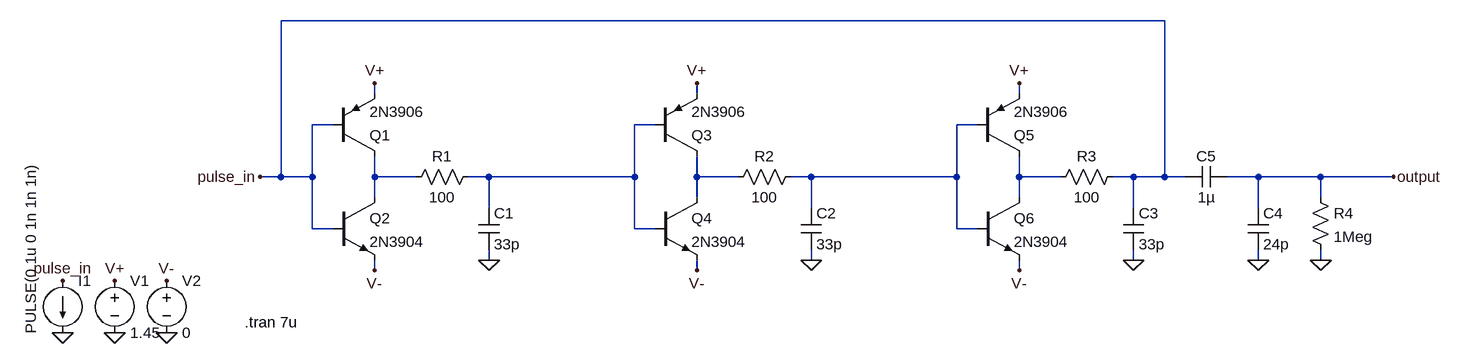
[diagram p0: schematic task1.asc]
task1.asc, the LTspice schematic file:
Version 4
SHEET 1 1920 680
WIRE 1472 -608 112 -608
WIRE 256 -496 256 -512
WIRE 752 -496 752 -512
WIRE 1248 -496 1248 -512
WIRE 192 -448 160 -448
WIRE 688 -448 656 -448
WIRE 1184 -448 1152 -448
WIRE 112 -368 112 -608
WIRE 112 -368 80 -368
WIRE 160 -368 160 -448
WIRE 160 -368 112 -368
WIRE 256 -368 256 -400
WIRE 320 -368 256 -368
WIRE 432 -368 400 -368
WIRE 656 -368 656 -448
WIRE 656 -368 432 -368
WIRE 752 -368 752 -400
WIRE 816 -368 752 -368
WIRE 928 -368 896 -368
WIRE 1152 -368 1152 -448
WIRE 1152 -368 928 -368
WIRE 1248 -368 1248 -400
WIRE 1312 -368 1248 -368
WIRE 1424 -368 1392 -368
WIRE 1472 -368 1472 -608
WIRE 1472 -368 1424 -368
WIRE 1504 -368 1472 -368
WIRE 1616 -368 1568 -368
WIRE 1712 -368 1616 -368
WIRE 1824 -368 1712 -368
WIRE 256 -336 256 -368
WIRE 752 -336 752 -368
WIRE 1248 -336 1248 -368
WIRE 1712 -336 1712 -368
WIRE 432 -320 432 -368
WIRE 928 -320 928 -368
WIRE 1424 -320 1424 -368
WIRE 1616 -320 1616 -368
WIRE 160 -288 160 -368
WIRE 192 -288 160 -288
WIRE 656 -288 656 -368
WIRE 688 -288 656 -288
WIRE 1152 -288 1152 -368
WIRE 1184 -288 1152 -288
WIRE 432 -240 432 -256
WIRE 928 -240 928 -256
WIRE 1424 -240 1424 -256
WIRE 1616 -240 1616 -256
WIRE 1712 -240 1712 -256
WIRE 256 -224 256 -240
WIRE 752 -224 752 -240
WIRE 1248 -224 1248 -240
FLAG -224 -208 pulse_in
FLAG -64 -128 0
FLAG -144 -128 0
FLAG -224 -128 0
FLAG -144 -208 V+
FLAG -64 -208 V-
FLAG 256 -512 V+
FLAG 432 -240 0
FLAG 80 -368 pulse_in
FLAG 256 -224 V-
FLAG 752 -512 V+
FLAG 928 -240 0
FLAG 752 -224 V-
FLAG 1248 -512 V+
FLAG 1424 -240 0
FLAG 1248 -224 V-
FLAG 1616 -240 0
FLAG 1712 -240 0
FLAG 1824 -368 output
SYMBOL current -224 -208 R0
WINDOW 3 -49 -182 VRight 2
WINDOW 123 0 0 Left 0
WINDOW 39 0 0 Left 0
SYMATTR Value PULSE(0 1u 0 1n 1n 1n)
SYMATTR InstName I1
SYMBOL voltage -144 -224 R0
WINDOW 123 0 0 Left 0
WINDOW 39 0 0 Left 0
SYMATTR InstName V1
SYMATTR Value 1.45
SYMBOL voltage -64 -224 R0
WINDOW 123 0 0 Left 0
WINDOW 39 0 0 Left 0
SYMATTR InstName V2
SYMATTR Value 0
SYMBOL pnp 192 -400 M180
SYMATTR InstName Q1
SYMATTR Value 2N3906
SYMBOL npn 192 -336 R0
SYMATTR InstName Q2
SYMATTR Value 2N3904
SYMBOL res 416 -384 R90
WINDOW 0 0 56 VBottom 2
WINDOW 3 32 56 VTop 2
SYMATTR InstName R1
SYMATTR Value 100
SYMBOL cap 416 -320 R0
SYMATTR InstName C1
SYMATTR Value 33p
SYMBOL pnp 688 -400 M180
SYMATTR InstName Q3
SYMATTR Value 2N3906
SYMBOL npn 688 -336 R0
SYMATTR InstName Q4
SYMATTR Value 2N3904
SYMBOL res 912 -384 R90
WINDOW 0 0 56 VBottom 2
WINDOW 3 32 56 VTop 2
SYMATTR InstName R2
SYMATTR Value 100
SYMBOL cap 912 -320 R0
SYMATTR InstName C2
SYMATTR Value 33p
SYMBOL pnp 1184 -400 M180
SYMATTR InstName Q5
SYMATTR Value 2N3906
SYMBOL npn 1184 -336 R0
SYMATTR InstName Q6
SYMATTR Value 2N3904
SYMBOL res 1408 -384 R90
WINDOW 0 0 56 VBottom 2
WINDOW 3 32 56 VTop 2
SYMATTR InstName R3
SYMATTR Value 100
SYMBOL cap 1408 -320 R0
SYMATTR InstName C3
SYMATTR Value 33p
SYMBOL cap 1600 -320 R0
SYMATTR InstName C4
SYMATTR Value 24p
SYMBOL cap 1568 -384 R90
WINDOW 0 0 32 VBottom 2
WINDOW 3 32 32 VTop 2
SYMATTR InstName C5
SYMATTR Value 1µ
SYMBOL res 1696 -352 R0
SYMATTR InstName R4
SYMATTR Value 1Meg
TEXT 56 -144 Left 2 !.tran 7u

The netlist it stands for:
* task1.asc
I1 pulse_in 0 PULSE(0 1u 0 1n 1n 1n)
V1 V+ 0 1.45
V2 V- 0 0
Q1 N003 pulse_in V+ 0 2N3906
Q2 N003 pulse_in V- 0 2N3904
R1 N001 N003 100
C1 N001 0 33p
Q3 N004 N001 V+ 0 2N3906
Q4 N004 N001 V- 0 2N3904
R2 N002 N004 100
C2 N002 0 33p
Q5 N005 N002 V+ 0 2N3906
Q6 N005 N002 V- 0 2N3904
R3 pulse_in N005 100
C3 pulse_in 0 33p
C4 output 0 24p
C5 output pulse_in 1µ
R4 output 0 1Meg
.model NPN NPN
.model PNP PNP
.lib standard.bjt
.tran 7u
.backanno
.end